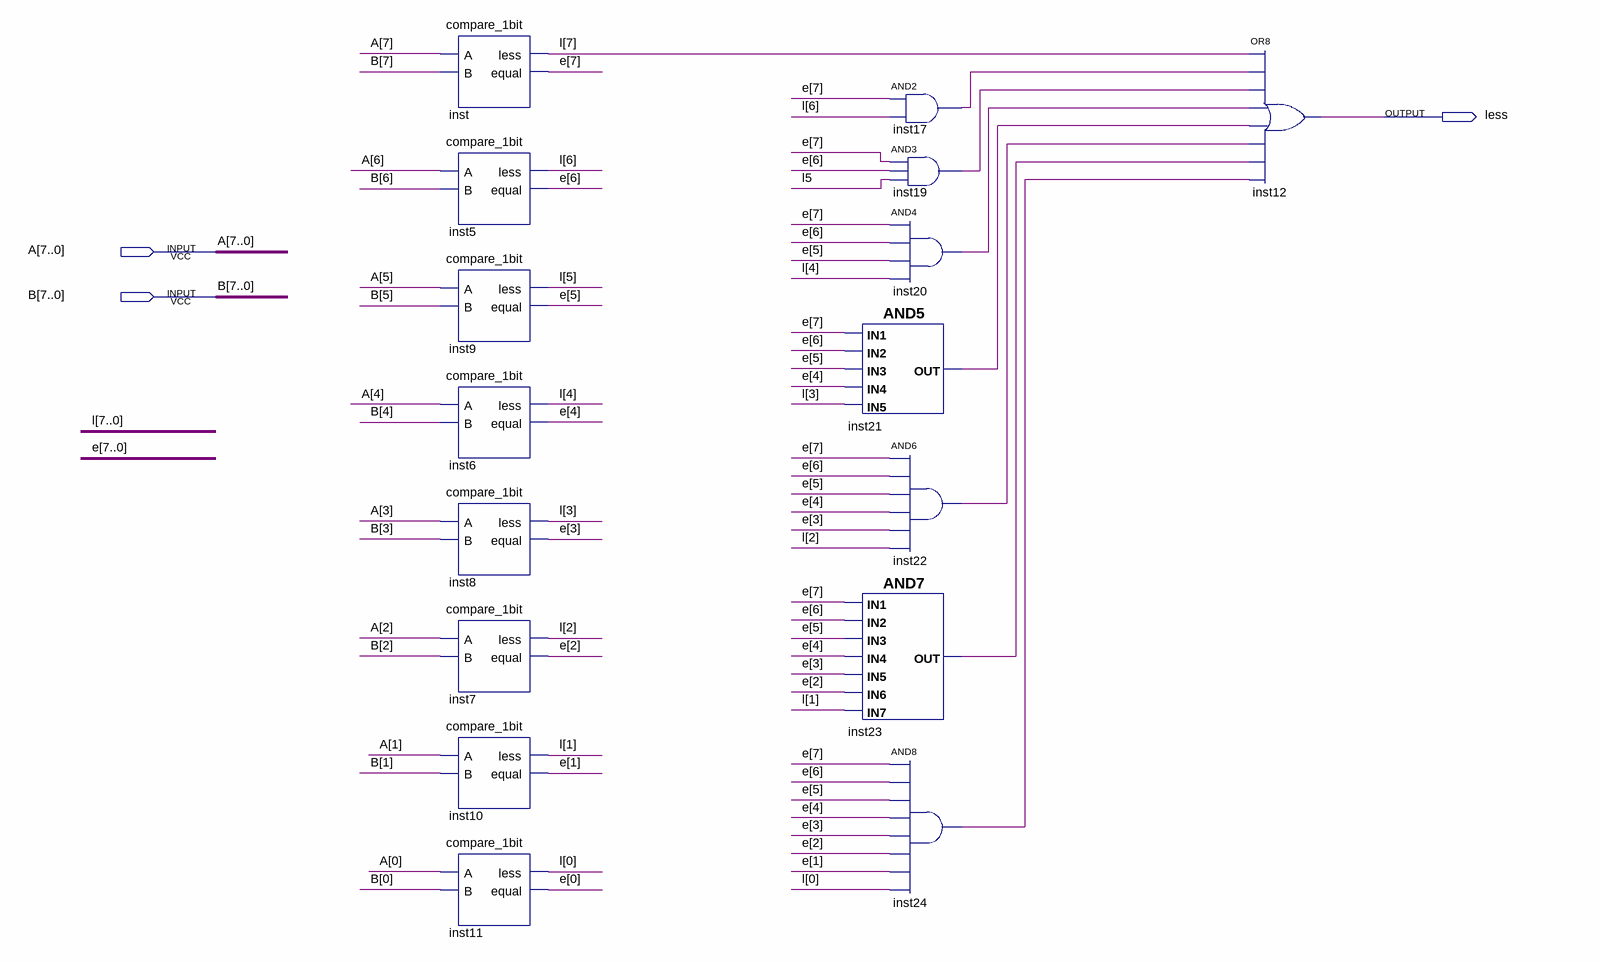
[diagram p0: schematic sheet]
// Quartus schematic compare_8bit.bdf as structural Verilog: 16 symbols, 3 pins
module compare_8bit (
  input  [7:0] A,
  input  [7:0] B,
  output less
);

  wire inst17_out, inst19_out, inst20_out, inst21_out, inst22_out, inst23_out, inst24_out;
  wire [7:0] e, l;

  compare_1bit inst (.A(A[7]), .B(B[7]), .less(l[7]), .equal(e[7]));
  compare_1bit inst5 (.A(A[6]), .B(B[6]), .less(l[6]), .equal(e[6]));
  compare_1bit inst9 (.A(A[5]), .B(B[5]), .less(l[5]), .equal(e[5]));
  compare_1bit inst6 (.A(A[4]), .B(B[4]), .less(l[4]), .equal(e[4]));
  compare_1bit inst8 (.A(A[3]), .B(B[3]), .less(l[3]), .equal(e[3]));
  compare_1bit inst7 (.A(A[2]), .B(B[2]), .less(l[2]), .equal(e[2]));
  compare_1bit inst10 (.A(A[1]), .B(B[1]), .less(l[1]), .equal(e[1]));
  compare_1bit inst11 (.A(A[0]), .B(B[0]), .less(l[0]), .equal(e[0]));
  and inst17 (inst17_out, e[7], l[6]);
  and inst19 (inst19_out, e[7], e[6], l[5]);
  and inst20 (inst20_out, e[7], e[6], e[5], l[4]);
  and inst21 (inst21_out, e[7], e[6], e[5], e[4], l[3]);
  and inst22 (inst22_out, e[7], e[6], e[5], e[4], e[3], l[2]);
  and inst23 (inst23_out, e[7], e[6], e[5], e[4], e[3], e[2], l[1]);
  and inst24 (inst24_out, e[7], e[6], e[5], e[4], e[3], e[2], e[1], l[0]);
  or inst12 (less, l[7], inst17_out, inst19_out, inst20_out, inst21_out, inst22_out, inst23_out, inst24_out);
endmodule
